# Altium schematic sheet [SCH]_IO.SchDoc: MOTHERBOARD
size 297 x 209 mm; CheckedBy: THIEN-KEMC; CompanyName: TEAM GA MO; DrawnBy: Vo Hao Hao; Organization: TEAM GA MO; Address1: TEAM GA MO Limited; Address2: 30, Nhat Hamet, Thanh Hoa, Phung Hiep, HG; TGM_Number: TGA-00005-03-1; Projet: EGG INCUBATION (PC-BASED MEASUREMENT AND CONTROL SYSTEMS); ModifiedBy: -; CreateDate: XX/XX/XXXX; CheckedDate: -; Title2: INPUT/OUTPUT; DivGrp: TGM; Designer: Vo Hao Hao
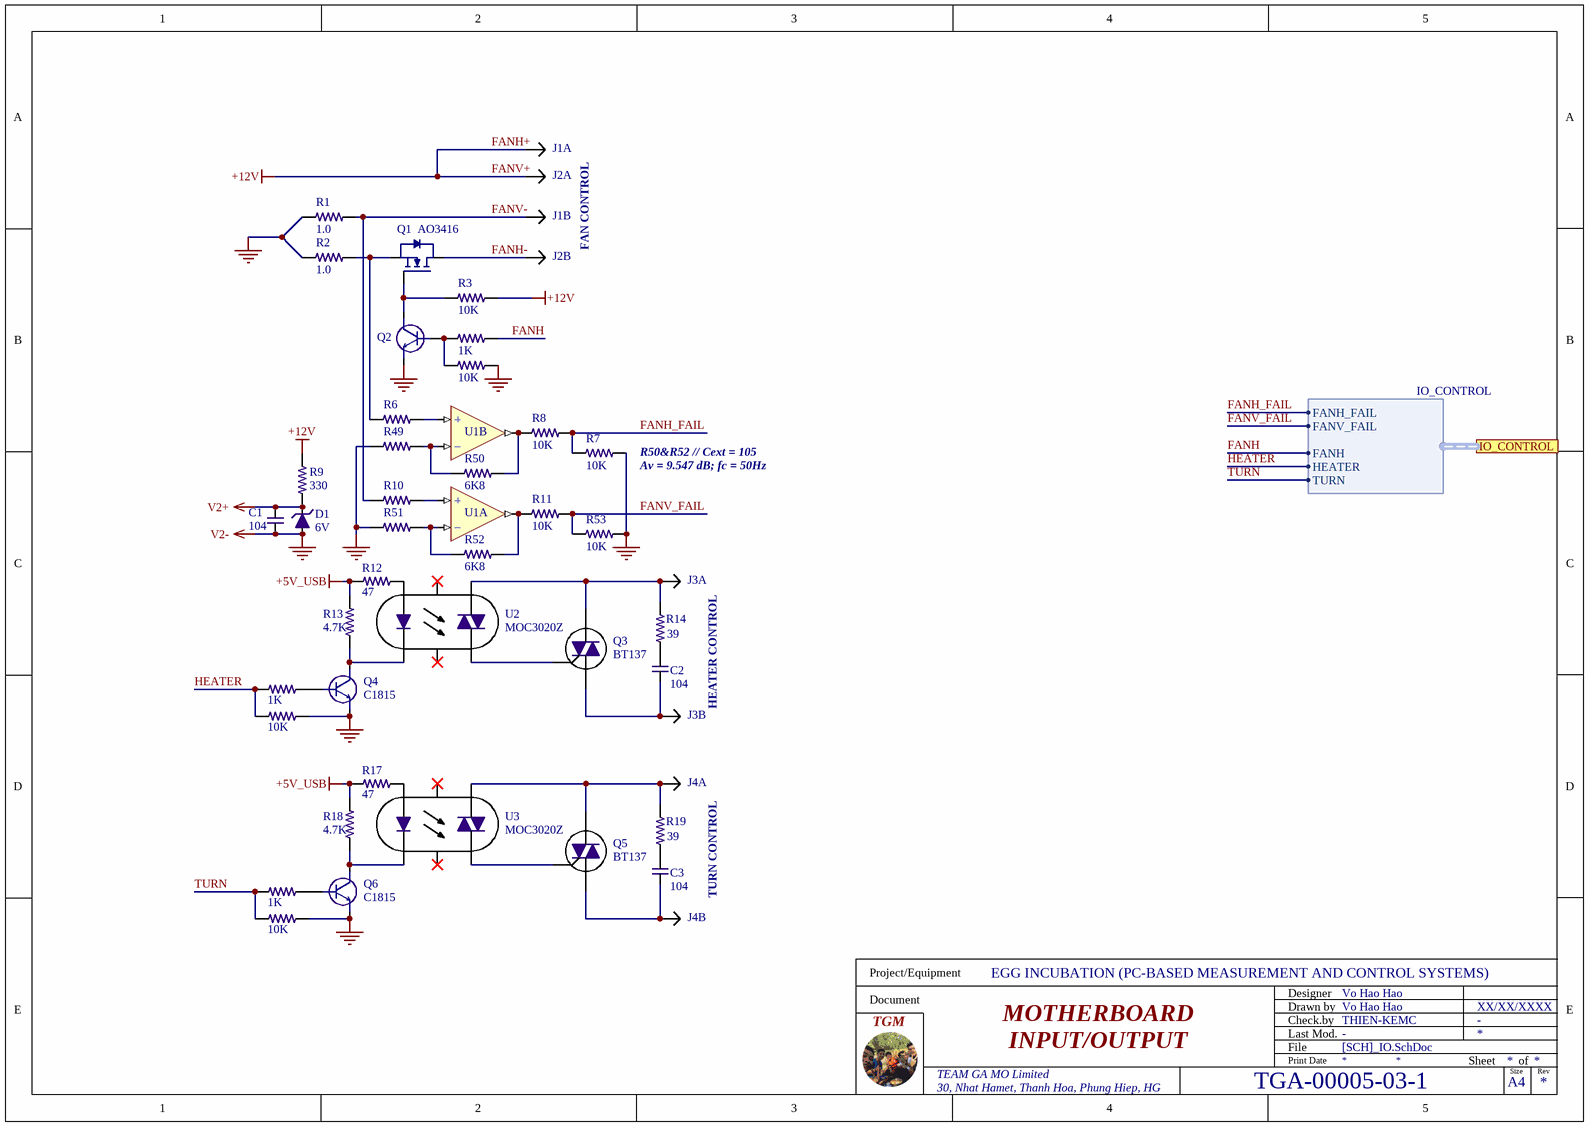
[diagram p0: [SCH]_IO.SchDoc]

## Parts
C1  104  [CAP-SMD-0805]
C2  104  [Cap-Mica-10-6.2x12.5x10.5]
C3  104  [Cap-Mica-10-6.2x12.5x10.5]
D1  6V  [DIO-SMD-123]
J1  FAN-HUMI  [KF2/5.08]  (value not drawn)  (parts A,B of 2)
J2  FAN-VENT  [KF2/5.08]  (value not drawn)  (parts A,B of 2)
J3  HEATER  [KF2/5.08]  (value not drawn)  (parts A,B of 2)
J4  TURN  [KF2/5.08]  (value not drawn)  (parts A,B of 2)
Q1  AO3416  [SOT23(123)]
Q2  NPN  [SOT23(123)]  (value not drawn)
Q3  BT137  [TO252AA]
Q4  C1815  [SOT23(123)]
Q5  BT137  [TO252AA]
Q6  C1815  [SOT23(123)]
R1  value 1.0  [RES-SMD-2512]  (hidden comment: RES-2512-4.7R)
R2  value 1.0  [RES-SMD-2512]  (hidden comment: RES-2512-4.7R)
R3  value 10K  [RES-SMD-0805]  (hidden comment: RES-2512-4.7R)
R4  value 1K  [RES-SMD-0805]  (hidden comment: RES-2512-4.7R)
R5  value 10K  [RES-SMD-0805]  (hidden comment: RES-2512-4.7R)
R6  RES-2512-4.7R  [RES-SMD-0805]  (value not drawn)
R7  value 10K  [RES-SMD-0805]  (hidden comment: RES-2512-4.7R)
R8  value 10K  [RES-SMD-0805]  (hidden comment: RES-2512-4.7R)
R9  value 330  [RES-SMD-0805]  (hidden comment: R0805)
R10  RES-2512-4.7R  [RES-SMD-0805]  (value not drawn)
R11  value 10K  [RES-SMD-0805]  (hidden comment: RES-2512-4.7R)
R12  value 47  [RES-SMD-0805]  (hidden comment: RES-2512-4.7R)
R13  value 4.7K  [RES-SMD-0805]  (hidden comment: RES-2512-4.7R)
R14  value 39  [RES-SMD-2512]  (hidden comment: RES)
R15  value 1K  [RES-SMD-0805]  (hidden comment: RES-2512-4.7R)
R16  value 10K  [RES-SMD-0805]  (hidden comment: RES-2512-4.7R)
R17  value 47  [RES-SMD-0805]  (hidden comment: RES-2512-4.7R)
R18  value 4.7K  [RES-SMD-0805]  (hidden comment: RES-2512-4.7R)
R19  value 39  [RES-SMD-2512]  (hidden comment: RES)
R20  value 1K  [RES-SMD-0805]  (hidden comment: RES-2512-4.7R)
R21  value 10K  [RES-SMD-0805]  (hidden comment: RES-2512-4.7R)
R49  RES-2512-4.7R  [RES-SMD-0805]  (value not drawn)
R50  value 6K8  [RES-SMD-0805]  (hidden comment: RES-2512-4.7R)
R51  RES-2512-4.7R  [RES-SMD-0805]  (value not drawn)
R52  value 6K8  [RES-SMD-0805]  (hidden comment: RES-2512-4.7R)
R53  value 10K  [RES-SMD-0805]  (hidden comment: RES-2512-4.7R)
U1  LM358  [SOIC-8S]  (value not drawn)  (parts A,B of 2)
U2  MOC3020Z  [DIP6]
U3  MOC3020Z  [DIP6]

## Ports
IO_CONTROL (harness IO_CONTROL)

## Harnesses
IO_CONTROL: FANH_FAIL, FANV_FAIL, FANH, HEATER, TURN

## Nets
+5V_USB: R12.2 R13.1 R17.2 R18.1
FANH+: J1.1 J2.1 R3.2 R9.2  [also labelled +12V, FANV+]
GND: C1.1 D1.1 Q2.3(E) Q4.3(E) Q6.3(E) R1.1 R2.1 R5.2 R7.2 R16.2 R21.2 R49.1 R51.1 R53.2 U1.4(V-)  [also labelled V2-]
V2+: C1.2 D1.2 R9.1 U1.8(V+)
FANH: R4.2 ; port IO_CONTROL.FANH
FANH-: J2.2 Q1.2(D)
FANH_FAIL: R7.1 R8.2 ; port IO_CONTROL.FANH_FAIL
FANV-: J1.2 R1.2 R10.1
FANV_FAIL: R11.2 R53.1 ; port IO_CONTROL.FANV_FAIL
HEATER: R15.1 R16.1 ; port IO_CONTROL.HEATER
TURN: R20.1 R21.1 ; port IO_CONTROL.TURN
NetC2_1: C2.1 J3.2 Q3.1(T1)
NetC2_2: C2.2 R14.1
NetC3_1: C3.1 J4.2 Q5.1(T1)
NetC3_2: C3.2 R19.1
NetJ3_1: J3.1 Q3.2(T2) R14.2 U2.6
NetJ4_1: J4.1 Q5.2(T2) R19.2 U3.6
NetQ1_1: Q1.1(G) Q2.2(C) R3.1
NetQ1_3: Q1.3(S) R2.2 R6.1
NetQ2_1: Q2.1(B) R4.1 R5.1
NetQ3_3: Q3.3(G) U2.4
NetQ4_1: Q4.1(B) R15.2
NetQ4_2: Q4.2(C) R13.2 U2.2
NetQ5_3: Q5.3(G) U3.4
NetQ6_1: Q6.1(B) R20.2
NetQ6_2: Q6.2(C) R18.2 U3.2
NetR6_2: R6.2 U1.5(+IN)
NetR8_1: R8.1 R50.2 U1.7(OUT)
NetR10_2: R10.2 U1.3(+IN)
NetR11_1: R11.1 R52.2 U1.1(OUT)
NetR12_1: R12.1 U2.1
NetR17_1: R17.1 U3.1
NetR49_2: R49.2 R50.1 U1.6(-IN)
NetR51_2: R51.2 R52.1 U1.2(-IN)

Not connected (* = marked no-connect by the designer): U2 3* 5*; U3 3* 5*

## Notes on the sheet
- FAN CONTROL
- (near R7) R50&R52 // Cext = 105
- (near R7) Av = 9.547 dB; fc = 50Hz
- (near J3) HEATER CONTROL
- TURN CONTROL
- Project/Equipment
- Document
- Designer
- Drawn by
- Check.by
- File
- Last Mod.
- Print Date
- Sheet
- Size
- A4
- of
- Rev

## Library data of the parts
C1 = Cap-Non-SMD: Non-polar capacitor
C2 C3 = Cap-Non-DIP: Non-polar capacitor; Price: 0.005
D1 = ZENER: DIODE-ZNR 5.1V 5% PD=1W IR=10uA; Manufacturer: Littlefuse Inc.; Manufacturer’s ordering code: SMF22A; Value: 24.4V; Part Number: SMF22A; Supplier 1: Digi-Key; Supplier 2: Mouser; Supplier Part Number 1: F5822CT-ND; Supplier Part Number 2: 576-SMF22A; Supplier 3: LCSC; Supplier Part Number 3: C169431
J1-J4 = JP2
Q1 = IRFR3910TRLPBF: N-Channel 16A (Tc) 79W (Tc) Surface Mount D-Pak; Supplier 1: Digi-Key; Supplier 2: Mouser; Supplier 3: LCSC; Supplier Part Number 1: IRFR3910TRLPBFCT-ND; Supplier Part Number 2: 942-IRFR3910TRLPBF; Supplier Part Number 3: C148158; Price: 0.15
Q2 Q4 Q6 = NPN: Transistor, NPN, RF, 50mA, 12V; Supplier 1: Digi-Key; Supplier Part Number 1: 568-11514-1-ND
Q3 Q5 = SCR: THYRISTOR-TRIAC TO-220AB VRRM=600
R1-R5 R7-R9 R11-R21 R50 R52 R53 = RES: Chip Resistor, 0805, 1%, 1/8 W; PackageReference: J1-0805; PackageDescription: Chip Resistor; Supplier Part Number 1: 311-1.00KLRCT-ND; Price: 0.005
R6 R10 R49 R51 = RES: Chip Resistor, 0805, 1%, 1/8 W; Value: 1K; PackageReference: J1-0805; PackageDescription: Chip Resistor; Supplier Part Number 1: 311-1.00KLRCT-ND; Price: 0.005
U1 = LM358: 7mV 250nA 7uV/C 1MHz 0.6V/uS 0.8mA 3-32V; Price: 0.24
U2 U3 = MOC3020Z: OPTO-ISOLATOR LED-PTRIAC IF=50mA-max